# Altium schematic sheet sonar_peripherals.SchDoc
size A
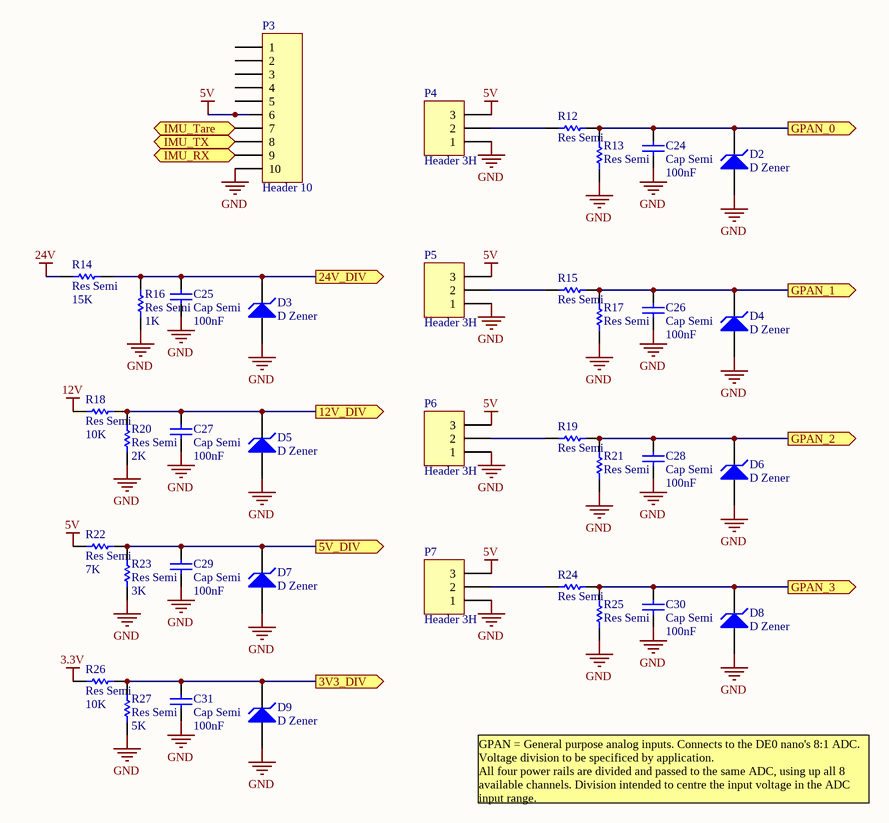
[diagram p0: sonar_peripherals.SchDoc]

## Parts
C24  Cap Semi  value 100nF  [C0805]
C25  Cap Semi  value 100nF  [C0805]
C26  Cap Semi  value 100nF  [C0805]
C27  Cap Semi  value 100nF  [C0805]
C28  Cap Semi  value 100nF  [C0805]
C29  Cap Semi  value 100nF  [C0805]
C30  Cap Semi  value 100nF  [C0805]
C31  Cap Semi  value 100nF  [C0805]
D2  D Zener  [SOD-323]
D3  D Zener  [SOD-323]
D4  D Zener  [SOD-323]
D5  D Zener  [SOD-323]
D6  D Zener  [SOD-323]
D7  D Zener  [SOD-323]
D8  D Zener  [SOD-323]
D9  D Zener  [SOD-323]
P3  Header 10  [Harwin_IMU_recp]
P4  Header 3H  [HDR1X3H]
P5  Header 3H  [HDR1X3H]
P6  Header 3H  [HDR1X3H]
P7  Header 3H  [HDR1X3H]
R12  Res Semi  [6-0805_M]
R13  Res Semi  [6-0805_M]
R14  Res Semi  value 15K  [6-0805_M]
R15  Res Semi  [6-0805_M]
R16  Res Semi  value 1K  [6-0805_M]
R17  Res Semi  [6-0805_M]
R18  Res Semi  value 10K  [6-0805_M]
R19  Res Semi  [6-0805_M]
R20  Res Semi  value 2K  [6-0805_M]
R21  Res Semi  [6-0805_M]
R22  Res Semi  value 7K  [6-0805_M]
R23  Res Semi  value 3K  [6-0805_M]
R24  Res Semi  [6-0805_M]
R25  Res Semi  [6-0805_M]
R26  Res Semi  value 10K  [6-0805_M]
R27  Res Semi  value 5K  [6-0805_M]

## Ports
3V3_DIV (out), 5V_DIV (out), 12V_DIV (out), 24V_DIV (out), GPAN_0 (out), GPAN_1 (out), GPAN_2 (out), GPAN_3 (out), IMU_RX (in), IMU_Tare (in), IMU_TX (out)

## Nets
3.3V: R26.1
5V: P3.6 P4.3 P5.3 P6.3 P7.3 R22.1
12V: R18.1
24V: R14.1
GND: C24.1 C25.1 C26.1 C27.1 C28.1 C29.1 C30.1 C31.1 D2.1(A) D3.1(A) D4.1(A) D5.1(A) D6.1(A) D7.1(A) D8.1(A) D9.1(A) P3.10 P4.1 P5.1 P6.1 P7.1 R13.1 R16.1 R17.1 R20.1 R21.1 R23.1 R25.1 R27.1
3V3_DIV: C31.2 D9.2(K) R26.2 R27.2 ; port 3V3_DIV
5V_DIV: C29.2 D7.2(K) R22.2 R23.2 ; port 5V_DIV
12V_DIV: C27.2 D5.2(K) R18.2 R20.2 ; port 12V_DIV
24V_DIV: C25.2 D3.2(K) R14.2 R16.2 ; port 24V_DIV
GPAN_0: C24.2 D2.2(K) R12.2 R13.2 ; port GPAN_0
GPAN_1: C26.2 D4.2(K) R15.2 R17.2 ; port GPAN_1
GPAN_2: C28.2 D6.2(K) R19.2 R21.2 ; port GPAN_2
GPAN_3: C30.2 D8.2(K) R24.2 R25.2 ; port GPAN_3
IMU_RX: P3.9 ; port IMU_RX
IMU_Tare: P3.7 ; port IMU_Tare
IMU_TX: P3.8 ; port IMU_TX
NetP4_2: P4.2 R12.1
NetP5_2: P5.2 R15.1
NetP6_2: P6.2 R19.1
NetP7_2: P7.2 R24.1

Not connected (* = marked no-connect by the designer): P3 1 2 3 4 5

## Notes on the sheet
- GPAN = General purpose analog inputs. Connects to the DE0 nano's 8:1 ADC.  Voltage division to be specificed by application.
  All four power rails are divided and passed to the same ADC, using up all 8 available channels. Division intended to centre the input voltage in the ADC input range.

## Library data of the parts
C24-C31 = Cap Semi: Capacitor (Semiconductor SIM Model); Published: 8-Jun-2000; LatestRevisionDate: 29-May-2009; LatestRevisionNote: IPC-7351 Footprint Added.; PackageReference: C1206; Publisher: Altium Limited; PackageDescription: Chip Capacitor
D2-D9 = D Zener: Zener Diode; Published: 8-Jun-2000; LatestRevisionDate: 17-Jul-2002; LatestRevisionNote: Re-released for DXP Platform.; PackageReference: DIODE-0.7; Publisher: Altium Limited; PackageDescription: Diode, Thru-Hole; 2 Leads; 0.7 in Pin Spacing
P3 = Header 10: Header, 10-Pin; Manufacturer PN: M80-5401042; LatestRevisionDate: 17-Jul-2002; LatestRevisionNote: Re-released for DXP Platform.; Publisher: Altium Limited; Mouser PN: 855-M80-5401042
P4-P7 = Header 3H: Header, 3-Pin, Right Angle; LatestRevisionDate: 17-Jul-2002; LatestRevisionNote: Re-released for DXP Platform.; Publisher: Altium Limited
R12 R15 R19 R24 = Res Semi: Semiconductor Resistor; Value: 10K; Published: 8-Jun-2000; LatestRevisionDate: 17-Jul-2002; LatestRevisionNote: Re-released for DXP Platform.; PackageReference: AXIAL-0.5; Publisher: Altium Limited; PackageDescription: Axial Device, Thru-Hole; 2 Leads; 0.5 in Pin Spacing
R13 R17 R21 R25 = Res Semi: Semiconductor Resistor; Value: 2K; Published: 8-Jun-2000; LatestRevisionDate: 17-Jul-2002; LatestRevisionNote: Re-released for DXP Platform.; PackageReference: AXIAL-0.5; Publisher: Altium Limited; PackageDescription: Axial Device, Thru-Hole; 2 Leads; 0.5 in Pin Spacing
R14 R16 R18 R20 R22 R23 R26 R27 = Res Semi: Semiconductor Resistor; Published: 8-Jun-2000; LatestRevisionDate: 17-Jul-2002; LatestRevisionNote: Re-released for DXP Platform.; PackageReference: AXIAL-0.5; Publisher: Altium Limited; PackageDescription: Axial Device, Thru-Hole; 2 Leads; 0.5 in Pin Spacing